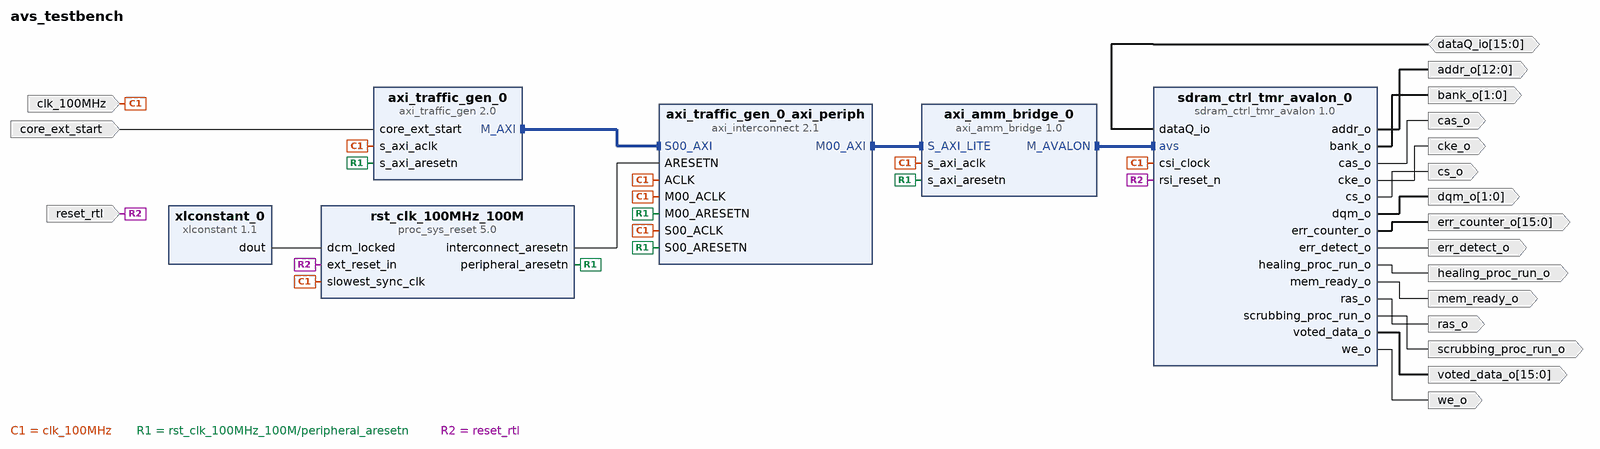
[diagram p0: block diagram of the top level]
# Vivado block design avs_testbench, xc7a200tfbg676-1, Vivado 2016.4
create_bd_design avs_testbench

create_bd_port -dir I -type clk clk_100MHz
set_property -dict {CONFIG.FREQ_HZ 100000000} [get_bd_ports clk_100MHz]
create_bd_port -dir I -type rst reset_rtl
set_property -dict {CONFIG.POLARITY ACTIVE_LOW} [get_bd_ports reset_rtl]
create_bd_port -dir I core_ext_start
create_bd_port -dir O cke_o
create_bd_port -dir O -from 1 -to 0 bank_o
create_bd_port -dir O -from 12 -to 0 addr_o
create_bd_port -dir O cs_o
create_bd_port -dir O ras_o
create_bd_port -dir O cas_o
create_bd_port -dir O we_o
create_bd_port -dir O -from 1 -to 0 dqm_o
create_bd_port -dir IO -from 15 -to 0 dataQ_io
create_bd_port -dir O mem_ready_o
create_bd_port -dir O err_detect_o
create_bd_port -dir O -from 15 -to 0 err_counter_o
create_bd_port -dir O -from 15 -to 0 voted_data_o
create_bd_port -dir O scrubbing_proc_run_o
create_bd_port -dir O healing_proc_run_o

create_bd_cell -type ip -vlnv xilinx.com:ip:axi_amm_bridge:1.0 axi_amm_bridge_0
set_property -dict [list \
  CONFIG.C_HAS_READ_DATA_VALID 0 \
  CONFIG.C_S_AXI_ADDR_WIDTH 24 \
  CONFIG.C_USE_BYTEENABLE 0 \
  CONFIG.C_HAS_RESPONSE 0 \
] [get_bd_cells axi_amm_bridge_0]
create_bd_cell -type ip -vlnv xilinx.com:ip:axi_traffic_gen:2.0 axi_traffic_gen_0
set_property -dict [list \
  CONFIG.C_ATG_SYSTEM_CMD_MAX_RETRY 256 \
  CONFIG.C_ATG_STATIC_HLTP_INCR true \
  CONFIG.C_ATG_SYSTEM_INIT_ADDR_MIF demo_addr_traffic.coe \
  CONFIG.C_ATG_MODE AXI4 \
  CONFIG.C_ATG_SYSINIT_MODES System_Init \
  CONFIG.C_ATG_SYSTEM_CH1_HIGH 0x00FFFFFF \
  CONFIG.TRAFFIC_PROFILE Data \
  CONFIG.DATA_SIZE_AVG 16 \
  CONFIG.C_ATG_REPEAT_TYPE One_Shot \
  CONFIG.MASTER_HIGH_ADDRESS 0x00FFFFFF \
  CONFIG.ATG_OPTIONS {High Level Traffic} \
  CONFIG.ATG_HLT_STATIC_LENGTH 1 \
  CONFIG.ATG_HLT_STATIC_LENGTH_INCR 1 \
] [get_bd_cells axi_traffic_gen_0]
create_bd_cell -type ip -vlnv xilinx.com:ip:proc_sys_reset:5.0 rst_clk_100MHz_100M
create_bd_cell -type ip -vlnv xilinx.com:ip:axi_interconnect:2.1 axi_traffic_gen_0_axi_periph
set_property -dict {CONFIG.NUM_MI 1} [get_bd_cells axi_traffic_gen_0_axi_periph]
create_bd_cell -type ip -vlnv xilinx.com:ip:xlconstant:1.1 xlconstant_0
create_bd_cell -type ip -vlnv ekyr.kth.se:user:sdram_ctrl_tmr_avalon:1.0 sdram_ctrl_tmr_avalon_0

# ---- connections ----

connect_bd_intf_net [get_bd_intf_pins axi_amm_bridge_0/M_AVALON] [get_bd_intf_pins sdram_ctrl_tmr_avalon_0/avs]
connect_bd_intf_net [get_bd_intf_pins axi_traffic_gen_0/M_AXI] [get_bd_intf_pins axi_traffic_gen_0_axi_periph/S00_AXI]
connect_bd_intf_net [get_bd_intf_pins axi_traffic_gen_0_axi_periph/M00_AXI] [get_bd_intf_pins axi_amm_bridge_0/S_AXI_LITE]
connect_bd_net [get_bd_ports clk_100MHz] \
  [get_bd_pins axi_traffic_gen_0/s_axi_aclk] [get_bd_pins axi_amm_bridge_0/s_axi_aclk] \
  [get_bd_pins rst_clk_100MHz_100M/slowest_sync_clk] [get_bd_pins axi_traffic_gen_0_axi_periph/ACLK] \
  [get_bd_pins axi_traffic_gen_0_axi_periph/M00_ACLK] [get_bd_pins axi_traffic_gen_0_axi_periph/S00_ACLK] \
  [get_bd_pins sdram_ctrl_tmr_avalon_0/csi_clock]
connect_bd_net [get_bd_pins rst_clk_100MHz_100M/peripheral_aresetn] \
  [get_bd_pins axi_traffic_gen_0/s_axi_aresetn] [get_bd_pins axi_amm_bridge_0/s_axi_aresetn] \
  [get_bd_pins axi_traffic_gen_0_axi_periph/S00_ARESETN] [get_bd_pins axi_traffic_gen_0_axi_periph/M00_ARESETN]
connect_bd_net [get_bd_ports reset_rtl] [get_bd_pins rst_clk_100MHz_100M/ext_reset_in] [get_bd_pins sdram_ctrl_tmr_avalon_0/rsi_reset_n]
connect_bd_net [get_bd_ports core_ext_start] [get_bd_pins axi_traffic_gen_0/core_ext_start]
connect_bd_net [get_bd_pins sdram_ctrl_tmr_avalon_0/cke_o] [get_bd_ports cke_o]
connect_bd_net [get_bd_pins sdram_ctrl_tmr_avalon_0/bank_o] [get_bd_ports bank_o]
connect_bd_net [get_bd_pins sdram_ctrl_tmr_avalon_0/addr_o] [get_bd_ports addr_o]
connect_bd_net [get_bd_pins sdram_ctrl_tmr_avalon_0/cs_o] [get_bd_ports cs_o]
connect_bd_net [get_bd_pins sdram_ctrl_tmr_avalon_0/ras_o] [get_bd_ports ras_o]
connect_bd_net [get_bd_pins sdram_ctrl_tmr_avalon_0/cas_o] [get_bd_ports cas_o]
connect_bd_net [get_bd_pins sdram_ctrl_tmr_avalon_0/we_o] [get_bd_ports we_o]
connect_bd_net [get_bd_pins sdram_ctrl_tmr_avalon_0/dqm_o] [get_bd_ports dqm_o]
connect_bd_net [get_bd_ports dataQ_io] [get_bd_pins sdram_ctrl_tmr_avalon_0/dataQ_io]
connect_bd_net [get_bd_pins sdram_ctrl_tmr_avalon_0/mem_ready_o] [get_bd_ports mem_ready_o]
connect_bd_net [get_bd_pins sdram_ctrl_tmr_avalon_0/err_detect_o] [get_bd_ports err_detect_o]
connect_bd_net [get_bd_pins sdram_ctrl_tmr_avalon_0/err_counter_o] [get_bd_ports err_counter_o]
connect_bd_net [get_bd_pins sdram_ctrl_tmr_avalon_0/voted_data_o] [get_bd_ports voted_data_o]
connect_bd_net [get_bd_pins sdram_ctrl_tmr_avalon_0/scrubbing_proc_run_o] [get_bd_ports scrubbing_proc_run_o]
connect_bd_net [get_bd_pins sdram_ctrl_tmr_avalon_0/healing_proc_run_o] [get_bd_ports healing_proc_run_o]
connect_bd_net [get_bd_pins rst_clk_100MHz_100M/interconnect_aresetn] [get_bd_pins axi_traffic_gen_0_axi_periph/ARESETN]
connect_bd_net [get_bd_pins xlconstant_0/dout] [get_bd_pins rst_clk_100MHz_100M/dcm_locked]

# ---- address map ----
assign_bd_address -offset 0x00000000 -range 16M -target_address_space [get_bd_addr_spaces axi_traffic_gen_0/Data] [get_bd_addr_segs axi_amm_bridge_0/S_AXI_LITE/Reg]

validate_bd_design
save_bd_design
